# Altium schematic sheet WR_clocks.SchDoc
size 419 x 296 mm; DocumentNumber: 52; SheetNumber: 52; SheetTotal: 54; $$Internal___BlkDate: 0:12:25_2-9-18; $$Internal_NAME_PLACEHOLDER: a3sheet; $$Internal_Resolution: 00001mm; $$NotCommonProperty_@NAME: WR_clocks; $$NotCommonProperty_@PRINTORDER: 26; $$NotCommonProperty_@SHEET: 26; $$NotCommonProperty_@SHEETTOTAL: 39; CmpIndex: 53; Drawing Author: G.Kasprowicz; Drawing Project: AMC FMC Carrier Board; Drawing Revision: 1.0; SymIndex: 2110
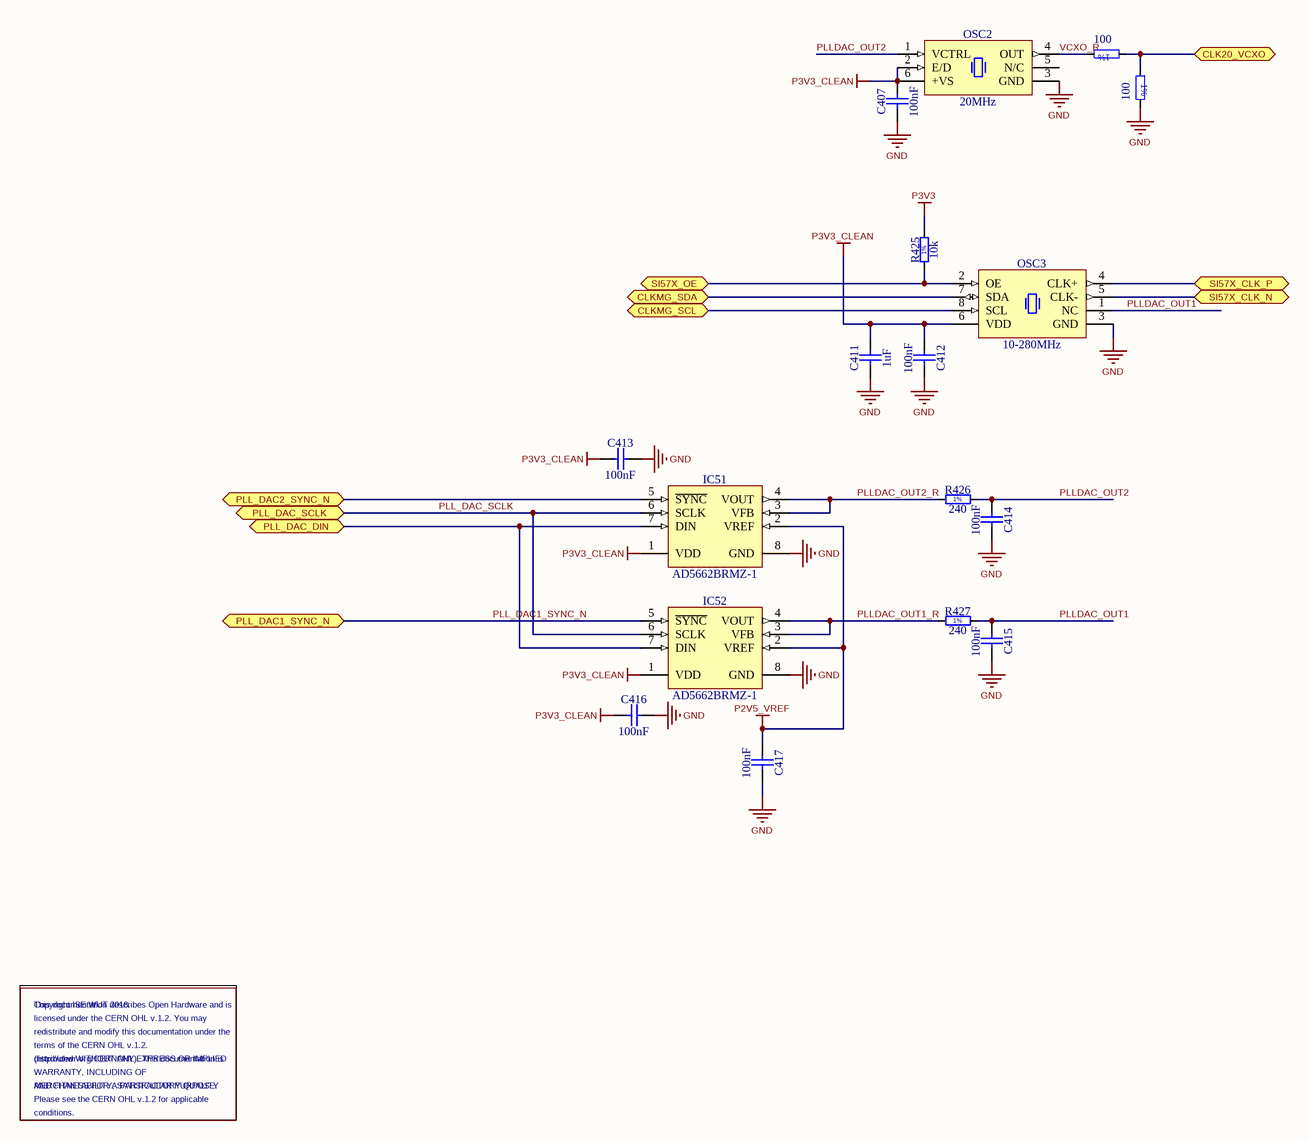
[diagram p0: WR_clocks.SchDoc]

## Parts
7  100
8  100
C407  100nF  [CAPC0603X33N]
C411  1uF  [CAPC1005X55N]
C412  100nF  [CAPC0603X33N]
C413  100nF  [CAPC0603X33N]
C414  100nF  [CAPC0603X33N]
C415  100nF  [CAPC0603X33N]
C416  100nF  [CAPC0603X33N]
C417  100nF  [CAPC0603X33N]
IC51  AD5662BRMZ-1  [SOP65P490X110-8N]
IC52  AD5662BRMZ-1  [SOP65P490X110-8N]
OSC2  20MHz  [OSC_IQD_CFPV-45]
OSC3  10-280MHz  [OSC_SILICON-LAB_SI570]
R425  10k  [RESC1005X40N]
R426  240  [RESC1005X40N]
R427  240  [RESC1005X40N]

## Ports
CLK20_VCXO (bidir), CLKMG_SCL (bidir), CLKMG_SDA (bidir), PLL_DAC1_SYNC_N (bidir), PLL_DAC2_SYNC_N (bidir), PLL_DAC_DIN (bidir), PLL_DAC_SCLK (bidir), SI57X_CLK_N (bidir), SI57X_CLK_P (bidir), SI57X_OE (bidir)

## Nets
GND: 8.2 C407.1 C411.1 C412.2 C413.2 C414.2 C415.2 C416.2 C417.2 IC51.8(GND) IC52.8(GND) OSC2.3(GND) OSC3.3(GND)
P2V5_VREF: C417.1 IC51.2(VREF) IC52.2(VREF)
P3V3: R425.2
P3V3_CLEAN: C407.2 C411.2 C412.1 C413.1 C416.1 IC51.1(VDD) IC52.1(VDD) OSC2.2(E/D) OSC2.6(+VS) OSC3.6(VDD)
CLK20_VCXO: 7.1 8.1 ; port CLK20_VCXO
CLKMG_SCL: OSC3.8(SCL) ; port CLKMG_SCL
CLKMG_SDA: OSC3.7(SDA) ; port CLKMG_SDA
PLL_DAC1_SYNC_N: IC52.5(~{SYNC}) ; port PLL_DAC1_SYNC_N
PLL_DAC2_SYNC_N: IC51.5(~{SYNC}) ; port PLL_DAC2_SYNC_N
PLL_DAC_DIN: IC51.7(DIN) IC52.7(DIN) ; port PLL_DAC_DIN
PLL_DAC_SCLK: IC51.6(SCLK) IC52.6(SCLK) ; port PLL_DAC_SCLK
PLLDAC_OUT1: C415.1 OSC3.1(NC) R427.2
PLLDAC_OUT1_R: IC52.3(VFB) IC52.4(VOUT) R427.1
PLLDAC_OUT2: C414.1 OSC2.1(VCTRL) R426.2
PLLDAC_OUT2_R: IC51.3(VFB) IC51.4(VOUT) R426.1
SI57X_CLK_N: OSC3.5(CLK-) ; port SI57X_CLK_N
SI57X_CLK_P: OSC3.4(CLK+) ; port SI57X_CLK_P
SI57X_OE: OSC3.2(OE) R425.1 ; port SI57X_OE
VCXO_R: 7.2 OSC2.4(OUT)

Not connected (* = marked no-connect by the designer): OSC2 5(N/C)

## Notes on the sheet
- Copyright ISE WUT 2018.
- redistribute and modify this documentation under the
- terms of the CERN OHL v.1.2.
- (http://ohwr.org/CERNOHL). This documentation is
- licensed under the CERN OHL v.1.2. You may
- This documentation describes Open Hardware and is
- distributed WITHOUT ANY EXPRESS OR IMPLIED
- MERCHANTABILITY, SATISFACTORY QUALITY
- Please see the CERN OHL v.1.2 for applicable
- conditions.
- WARRANTY, INCLUDING OF
- AND FITNESS FOR A PARTICULAR PURPOSE.
- TITLE
- SIZE
- DWG NO
- REV
- DRAWN BY
- A3
- SHEET
- of
- (in symbol 7) 1%
- (in symbol 8) 1%
- (in symbol R0402_10K_1%_0.0625W_100PPM) 1%
- (in symbol R0402_240R_1%_0.0625W_100PPM) 1%

## Library data of the parts
7 = (no symbol name): $$NotCommonProperty_General Part Number: R0402_100R_1%_0.1W_100PPM; $$NotCommonProperty_Manufacturer1 Example: PANASONIC; $$NotCommonProperty_Manufacturer1 Part Number: ERJ2RKF1000X; Manufacturer Part Number: R0402_100R_1%_0.1W_100PPM_50V; Manufacturer: GENERIC; Part Description: General Purpose Thick Film Chip Resistor; Part Name: Resistor - 1% RESC1005X40N; $$Internal_Resolution: 00001mm; $$NotCommonProperty_Case: 0402; $$NotCommonProperty_Cell: RESC1005X40N; $$NotCommonProperty_Pin Count: 2; $$NotCommonProperty_Power: 0.1W; $$NotCommonProperty_Sense: No; $$NotCommonProperty_SMD: Yes; $$NotCommonProperty_Status: Not recommended; $$NotCommonProperty_TC: ±100ppm/°C; $$NotCommonProperty_Voltage: 50V; CmpIndex: 9; DXDB_LIBNAME: Resistors SMD; SymIndex: 317; Tolerance: ±1%; $$Internal___BlkDate: 18:43:16_11-19-16; $$NotCommonProperty_Manufacturer1 ComponentHeight: 0.4mm; Cell Name: RESC1005X40N; Part Number: Resistor - 1% RESC1005X40N; Value: 100; Orientation: 2 = 2
8 = (no symbol name): $$NotCommonProperty_General Part Number: R0402_100R_1%_0.1W_100PPM; $$NotCommonProperty_Manufacturer1 Example: PANASONIC; $$NotCommonProperty_Manufacturer1 Part Number: ERJ2RKF1000X; Manufacturer Part Number: R0402_100R_1%_0.1W_100PPM_50V; Manufacturer: GENERIC; Part Description: General Purpose Thick Film Chip Resistor; Part Name: Resistor - 1% RESC1005X40N; $$Internal_Resolution: 00001mm; $$NotCommonProperty_Case: 0402; $$NotCommonProperty_Cell: RESC1005X40N; $$NotCommonProperty_Pin Count: 2; $$NotCommonProperty_Power: 0.1W; $$NotCommonProperty_Sense: No; $$NotCommonProperty_SMD: Yes; $$NotCommonProperty_Status: Not recommended; $$NotCommonProperty_TC: ±100ppm/°C; $$NotCommonProperty_Voltage: 50V; DXDB_LIBNAME: Resistors SMD; SymIndex: 317; Tolerance: ±1%; $$Internal___BlkDate: 18:43:16_11-19-16; $$NotCommonProperty_Manufacturer1 ComponentHeight: 0.4mm; Cell Name: RESC1005X40N; CmpIndex: 2; Part Number: Resistor - 1% RESC1005X40N; Value: 100; Orientation: 3 = 3
C407 C412-C417 = CC0201_100NF_6.3V_10%_X5R: Non-polarised capacitor; Manufacturer: GENERIC; Part Description: SMD Multilayer Chip Ceramic Capacitor; Manufacturer1 Part Number: 02016D104KAT2A; Tolerance: ±10%; Voltage: 6.3V; TC: X5R; Manufacturer Part Number: CC0201_100NF_6.3V_10%_X5R; Part Number: CC0201_100NF_6.3V_10%_X5R; Value: 100nF; Component Kind: Standard; Component Type: Standard; Pin Count: 2; Status: Not Recommended; Case: 0201; Mounted: Yes; Socket: No; SMD: Yes; Sense: No; Manufacturer1 Example: AVX; Manufacturer1 ComponentHeight: 0.33mm; HelpURL: \\cern.ch\dfs\Applications\Altium\Datasheets\CC0201_X5R_AVX.pdf; Author: CERN DEM JLC; CreateDate: 03/12/2007; LatestRevisionDate: 03/12/2007
C411 = CC0402_1UF_16V_10%_X5R: Non-polarised capacitor; Manufacturer: GENERIC; Part Description: SMD Multilayer Chip Ceramic Capacitor; Manufacturer1 Part Number: C1005X5R1C105KT; Tolerance: ±10%; Voltage: 16V; TC: X5R; Manufacturer Part Number: CC0402_1UF_16V_10%_X5R; Part Number: CC0402_1UF_16V_10%_X5R; Value: 1uF; Component Kind: Standard; Component Type: Standard; Pin Count: 2; Status: Preferred; Case: 0402; Mounted: Yes; Socket: No; SMD: Yes; Sense: No; Manufacturer1 Example: TDK; Manufacturer1 ComponentHeight: 0.55mm; HelpURL: \\cern.ch\dfs\Applications\Altium\Datasheets\CC0402_X5R_TDK_C.pdf; Author: CERN DEM JLC; CreateDate: 25/10/2012; LatestRevisionDate: 25/10/2012
IC51 IC52 = AD5662BRMZ-1: 2.7V to 5.5V, 250uA, Rail-to-Rail Output 16-Bit nanoDAC; Manufacturer: ANALOG DEVICES; PressFit: No; Bonding: No; Manufacturer Part Number: AD5662BRMZ-1; PackageDescription: SOP, 0.65mm, Pitch; 8 Pin, 3.0mm W X 3.0mm L X 1.10mm H Body, IPC Medium Density; Part Description: 2.7V to 5.5V, 250uA, Rail-to-Rail Output 16-Bit nanoDAC; Part Number: AD5662BRMZ-1; Component Kind: Standard; Component Type: Standard; Device: AD5662BRMZ-1; Pin Count: 8; Case: MSOP8; Mounted: Yes; Socket: No; SMD: Yes; Sense: No; ComponentHeight: 1.1mm; Author: CERN DEM JLC; HelpURL: \\cern.ch\dfs\Applications\Altium\Datasheets\AD5662BRMZ-1.pdf; CreateDate: 10/01/2011; LatestRevisionDate: 10/01/2011
OSC2 = OSC_20MHZ_IQD_LFVCXO026156: 3.3V ±100ppm 15pF HCMOS Tri-State Surface Mount Voltage Controlled Oscillator VCXO (CFPV-45 Serie); Part Description: 3.3V, ±100ppm, 15pF, 0..70°C, HCMOS Tri-State Surface Mount, VCXO Voltage Controlled Oscillator (CFPV-45 Series); Manufacturer: IQD FREQUENCY PRODUCTS; PressFit: No; Bonding: No; Part Number: OSC_20MHZ_IQD_LFVCXO026156; Component Kind: Standard; Component Type: Standard; PackageDescription: Oscillator, Side Concave, 2.54mm Pitch, 6 Pins, 5.00mm L X 7.00mm W X 1.70mm H, CFPV-45 Series; Value: 20MHz; Manufacturer Part Number: LFVCXO026156; Pin Count: 6; Mounted: Yes; Socket: No; SMD: Yes; Sense: No; ComponentHeight: 1.7mm; HelpURL: \\cern.ch\dfs\Applications\Altium\Datasheets\OSC_IQD_LFVCXO026156.pdf; Author: CERN DEM JLC; CreateDate: 24/01/2011; LatestRevisionDate: 03/11/2016
OSC3 = OSC_10-280MHZ_SILICON-LAB_Si570BBC000121DG: Any-Rate I2C Programmable XO Oscillator Si570 Serie; Manufacturer: SILICON LABS; Part Description: 10-280MHz 3.3V ±20ppm LVDS Any-Rate I2C Programmable XO Oscillator Si570 Series; PressFit: No; Bonding: No; Manufacturer Part Number: 570BBC000121DG; PackageDescription: Oscillator Si570 Serie, 8 pins, 5x7mm; Part Number: OSC_10-280MHZ_SILICON-LAB_Si570BBC000121DG; Value: 10-280MHz; Component Kind: Standard; Component Type: Standard; Pin Count: 8; Mounted: Yes; Socket: No; SMD: Yes; Sense: No; ComponentHeight: 1.85mm; HelpURL: \\cern.ch\dfs\Applications\Altium\Datasheets\OSC_SILICON-LAB_SI570.pdf; Author: CERN DEM JLC; CreateDate: 09/02/2010; LatestRevisionDate: 24/09/2013
R425 = R0402_10K_1%_0.0625W_100PPM: Resistor - 1%; Manufacturer: GENERIC; Part Description: General Purpose Thick Film Chip Resistor; Manufacturer1 Part Number: 232270671003L; TC: ±100ppm/°C; PressFit: No; Manufacturer Part Number: R0402_10K_1%_0.0625W_100PPM; Part Number: R0402_10K_1%_0.0625W_100PPM; Tolerance: ±1%; Value: 10k; Component Kind: Standard; Component Type: Standard; Pin Count: 2; Status: Not Recommended; Power: 0.0625W; Case: 0402; Mounted: Yes; Sense: No; Socket: No; SMD: Yes; Manufacturer1 Example: YAGEO PHYCOMP; Manufacturer1 ComponentHeight: 0.4mm; HelpURL: \\cern.ch\dfs\Applications\Altium\Datasheets\R0402_Phycomp_RC0402.pdf; Author: CERN DEM JLC; CreateDate: 03/12/2007; LatestRevisionDate: 17/10/2012
R426 R427 = R0402_240R_1%_0.0625W_100PPM: Resistor - 1%; Manufacturer: GENERIC; Part Description: General Purpose Thick Film Chip Resistor; Manufacturer1 Part Number: 232270672401L; TC: ±100ppm/°C; PressFit: No; Manufacturer Part Number: R0402_240R_1%_0.0625W_100PPM; Part Number: R0402_240R_1%_0.0625W_100PPM; Tolerance: ±1%; Value: 240; Component Kind: Standard; Component Type: Standard; Pin Count: 2; Status: Not Recommended; Power: 0.0625W; Case: 0402; Mounted: Yes; Sense: No; Socket: No; SMD: Yes; Manufacturer1 Example: YAGEO PHYCOMP; Manufacturer1 ComponentHeight: 0.4mm; HelpURL: \\cern.ch\dfs\Applications\Altium\Datasheets\R0402_Phycomp_RC0402.pdf; Author: CERN DEM JLC; CreateDate: 03/12/2007; LatestRevisionDate: 17/10/2012